# EAGLE design rfob (EAGLE 6.6.0)
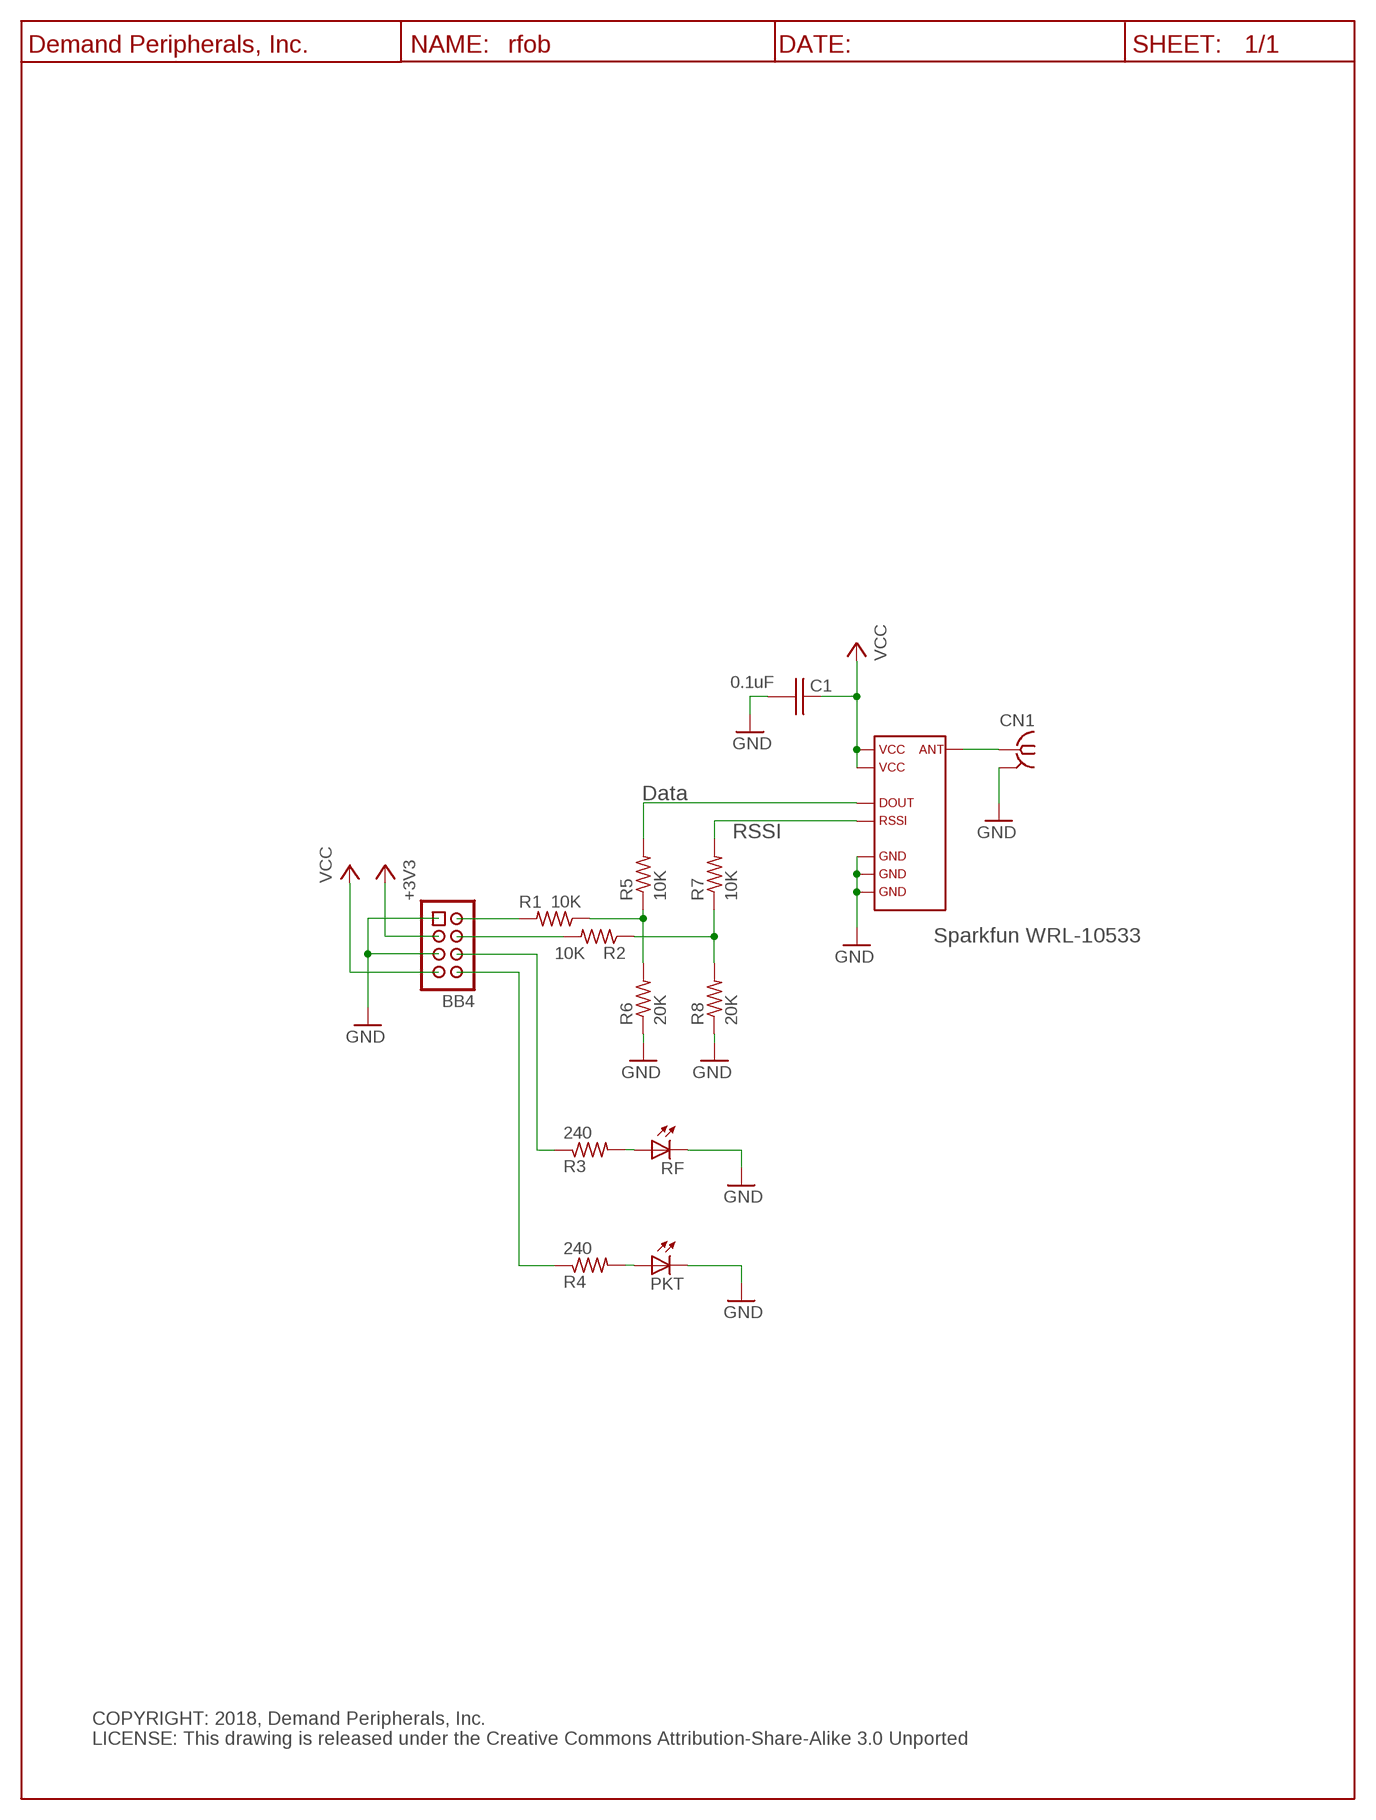
[diagram p0: schematic, sheet 1]

## Parts
BB4  Keyed_Pin_Header_4x2(0.1"x0.1")  HDR-4X2-SHR  [HDR-4X2]
C1  0.1uF  C0.1UF_C0603  [C0603]
CN1  BU-SMA-V  [BU-SMA-V]
PKT  LED-0805-RED  [0805]
R1  10K  R10K_R0603  [R0603]
R2  10K  R10K_R0603  [R0603]
R3  240  R240_  [R0603]
R4  240  R240_  [R0603]
R5  10K  R10K_R0603  [R0603]
R6  20K  R20K_R0603  [R0603]
R7  10K  R10K_R0603  [R0603]
R8  20K  R20K_R0603  [R0603]
RF  LED-0805-GRN  [0805]
RF1  RFLINK  [RFLINK]
U$1  DP_FRAME_P  [P_FRAME]

## Nets
+3V3: BB4.3
GND: BB4.1 BB4.5 C1.2 CN1.2 CN1.3 CN1.4 CN1.5 PKT.C R6.1 R8.1 RF1.1(GND1) RF1.6(GND3) RF1.7(GND2) RF.C
N$1: R3.2 RF.A
N$2: BB4.6 R3.1
N$3: R7.2 RF1.3(RSSI)
N$4: R2.1 R7.1 R8.2
N$5: R1.1 R5.1 R6.2
N$6: R5.2 RF1.2(DOUT)
N$7: BB4.8 R4.1
N$8: PKT.A R4.2
N$9: BB4.2 R1.2
N$10: BB4.4 R2.2
N$11: CN1.1 RF1.8(ANT)
VCC: BB4.7 C1.1 RF1.4(VCC1) RF1.5(VCC2)

## Notes on the sheet
- Data
- RSSI
- Sparkfun WRL-10533
- COPYRIGHT: 2018, Demand Peripherals, Inc.
  LICENSE: This drawing is released under the Creative Commons Attribution-Share-Alike 3.0 Unported

## Library data of the parts
BB4 = dpi-conn:HDR-4X2-SHR: Shrouded 4x2 pin header; VENDOR: Digikey; VENDOR-PART-NUM: 609-3530-ND
C1 = dpi-passive:C0.1UF_: 0.1 uF Capacitor, 25V, X7R; VENDOR: Digikey; VENDOR-PART-NUM: 1276-1126-2-ND
CN1 = dpi-conn:BU-SMA-V: FEMALE SMA CONNECTOR; VENDOR: Digikey; VENDOR-PART-NUM: A97594-ND
PKT = dpi-diopto:LED-0805-RED: Red 0805 LED, 41mcd@20ma, 160degree; VENDOR: Digikey; VENDOR-PART-NUM: 475-1415-6-ND
R1 R2 R5 R7 = dpi-passive:R10K_: 10K Resistor, 1%, 0.1 watt; VENDOR: Digikey; VENDOR-PART-NUM: 311-1.00KHRTR-ND
R3 R4 = dpi-passive:R240_: 240 Ohm resistor, 1%, 0.1 watt; VENDOR: Digikey; VENDOR-PART-NUM: 311-240HRTR-ND
R6 R8 = dpi-passive:R20K_: 20K Resistor, 1%, 0.1 watt; VENDOR: Digikey; VENDOR-PART-NUM: 311-20.0KHRTR-ND
RF = dpi-diopto:LED-0805-GRN: Green 0805 LED, 26mcd@20ma, 160degree; VENDOR: Digikey; VENDOR-PART-NUM: 475-1410-1-ND
RF1 = dpi-swsens:RFLINK: SparkFun RF-Link module or equivalent; VENDOR: Sparkfun; VENDOR-PART-NUM: WRL-10533
U$1 = dpi-sym:DP_FRAME_P: Portrait/Letter Document Frame

## Board
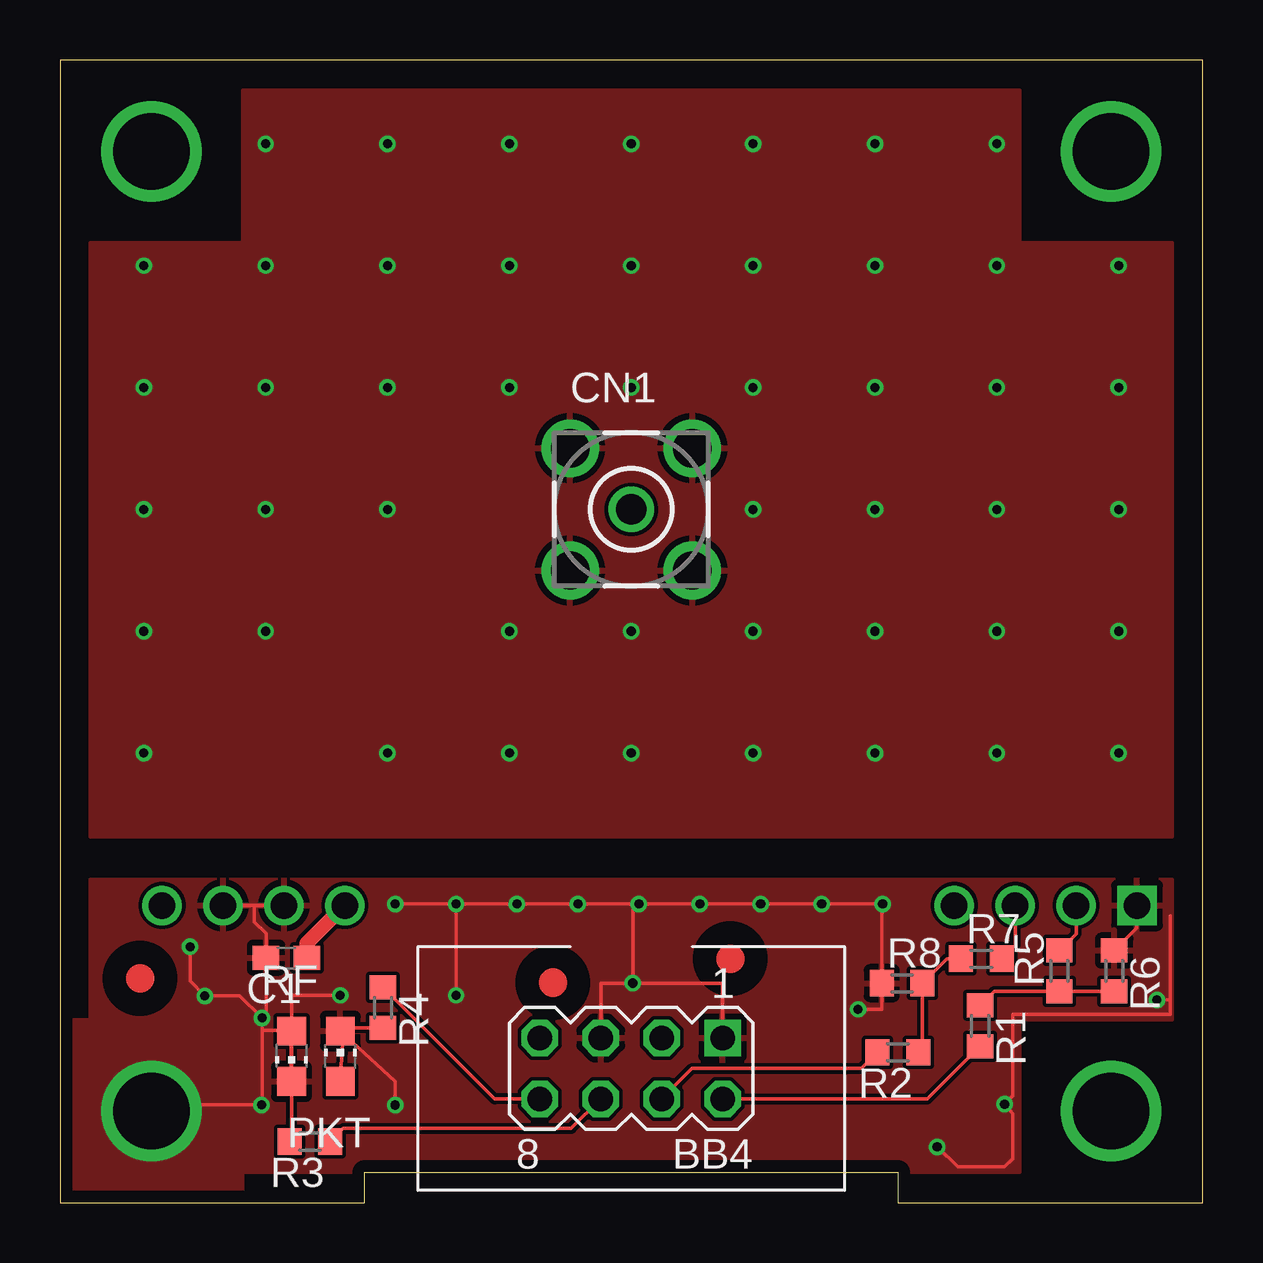
[diagram p1: board, top side]
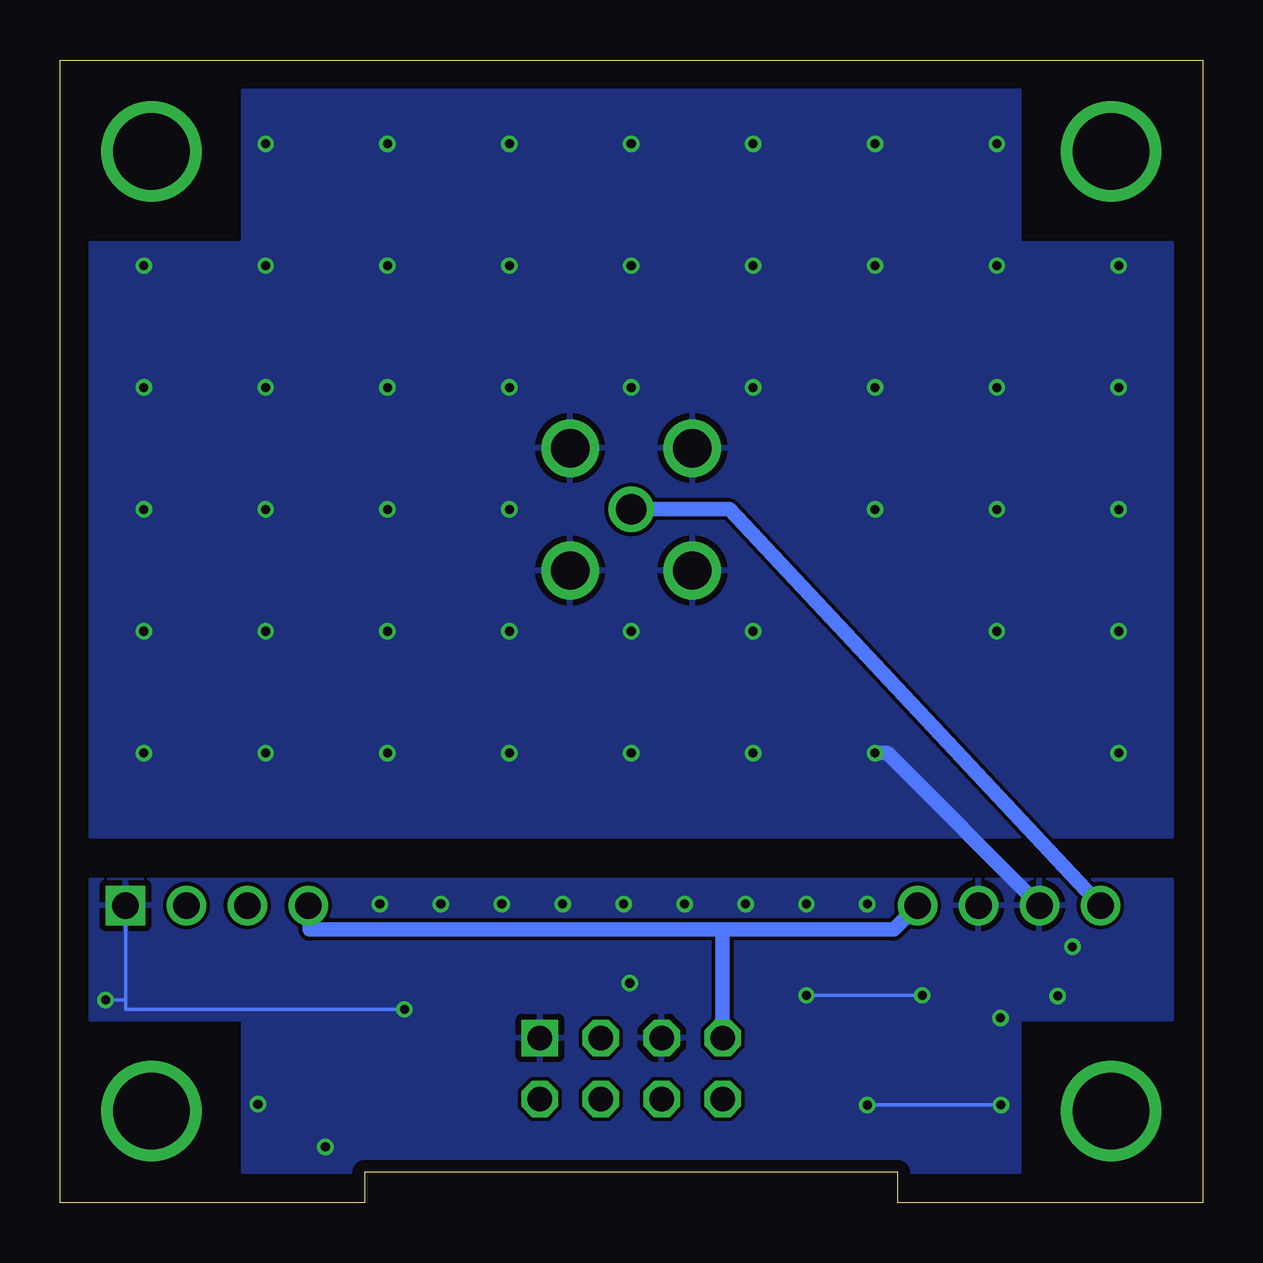
[diagram p2: board, bottom side, seen from below]

Size 47.62 x 47.62 mm. Coordinates in mm from the lower left corner, seen from the top.
Outline: 0,0 12.7,0 12.7,1.27 34.92,1.27 34.92,0 47.62,0 47.62,47.62 0,47.62 0,0
Copper layers (1*16): Top 0.035mm / dielectric 1.5mm / Bottom 0.035mm
Design rules "default *": minimum track width 6mil, minimum drill 15mil, track to track 6mil, track to pad 6mil, pad to pad 6mil, via to via 6mil, smd to smd 6mil, copper to edge 20mil, drill to drill 12mil, minimum pad ring 6mil, minimum via ring 6mil, stop-mask expansion 4mil, vias tented up to drill 0mil, thermal gap 10mil
tKeepout: area 15.1,1 to 32.5,10.2

### Footprints (pad centres in the part's own frame; a part is rotated, then mirrored left to right if it is on the bottom)
HDR-4X2 = drill 1.016 square: 1 -3.81,-1.27 | drill 1.016 octagon: 2 -3.81,1.27; 3 -1.27,-1.27; 4 -1.27,1.27; 5 1.27,-1.27; 6 1.27,1.27; 7 3.81,-1.27; 8 3.81,1.27
C0603 = smd 1.1 x 1: 1 -0.85,0; 2 0.85,0
BU-SMA-V = drill 1.27: 1 0,0 | drill 1.6: 2 -2.55,2.55; 3 2.55,2.55; 4 2.55,-2.55; 5 -2.55,-2.55
0805 = smd 1.2 x 1.2: A -1.05,0; C 1.05,0
R0603 = smd 1 x 1.1: 1 -0.85,0; 2 0.85,0
RFLINK = drill 1.1 square: 1 -20.32,0 | drill 1.1: 2 -17.78,0; 3 -15.24,0; 4 -12.7,0; 5 12.7,0; 6 15.24,0; 7 17.78,0; 8 20.32,0

### Placement (x,y rotation side)
BB4  23.81,5.59 180 top
C1  9.44,10.2 180 top
CN1  23.81,28.89 0 top
PKT  11.68,6.1 90 top
R1  38.35,7.37 270 top
R2  34.92,6.26 180 top
R3  10.41,2.54 180 top
R4  13.46,8.13 270 top
R5  41.66,9.65 90 top
R6  43.94,9.65 270 top
R7  38.4,10.16 0 top
R8  35.1,9.14 0 top
RF  9.65,6.1 270 top
RF1  24.57,12.38 180 top
U$1  -2.54,-2.54 0 top
U$2  [FIDUCIAL]  20.55,9.17 0 top
U$3  [FIDUCIAL]  27.94,10.16 0 top
U$4  [FIDUCIAL]  3.34,9.35 0 top
U$5  [DPI-2]  16.26,41.91 0 bottom

### Tracks (layer width: path | path; a pad name or v marks a point on that pad's centre or on a via)
GND  (via drill 0.38, 3.17 pad 3.17)
  Top 0.152: 46.29,8.45 46.29,7.84 39.72,7.84 39.72,4.44 v39.38,4.1 39.71,3.7 39.71,1.83 39.37,1.49 37.44,1.49 v36.56,2.32 | 46.29,8.45 46.29,11.94 | v13.97,12.45 v16.51,12.45 | v16.51,12.45 v19.05,12.45 v21.59,12.45 v24.13,12.45 | v26.67,12.45 v29.21,12.45 v31.75,12.45 v34.29,12.45 34.25,12.45 R8.1 34.25,8.05 v33.26,8.05 | v24.13,12.45 v26.67,12.45 | v45.72,8.44 46.29,8.44 46.29,8.45 | v26.67,12.45 27.62,12.45 | v24.13,12.45 22.54,12.45 | R6.1 44.9,11.45 RF1.1 | 8.42,7.18 8.42,4.09 v8.4,4.07 4.07,4.07 v3.81,3.81 | 8.42,7.18 v8.42,7.69 | 8.42,7.18 9.62,7.18 RF.C 9.65,8.64 v11.68,8.64 | v8.42,7.69 8.59,7.86 C1.2 8.59,11.21 8.1,11.7 8.1,12.37 8.12,12.38 | v8.42,7.69 7.5,8.61 v6.04,8.61 5.42,9.23 v5.42,10.66 | BB4.1 27.62,9.14 v23.88,9.14 | BB4.5 22.54,9.14 v23.88,9.14 | v23.88,9.14 23.88,12.45 v24.13,12.45 | v16.51,8.64 v16.51,12.45 | PKT.C 13.97,5.05 v13.97,4.06 | 8.59,12.38 RF1.6 8.12,12.38 | RF1.7 8.12,12.38
  Bottom 0.152: RF1.1 44.9,8.05 | 44.9,8.05 v33.26,8.05 | 44.9,8.05 44.9,8.44 v45.72,8.44 | v11.68,8.64 v16.51,8.64 | v13.97,4.06 v8.4,4.06 v8.4,4.07
  Bottom 0.61: v13.65,18.73 13.14,18.73 RF1.7
  other vias: 3.49,39.05 8.57,39.05 13.65,39.05 18.73,39.05 23.81,39.05 28.89,39.05 33.97,39.05 39.05,39.05 44.13,39.05 8.57,44.13 13.65,44.13 18.73,44.13 23.81,44.13 28.89,44.13 33.97,44.13 3.49,33.97 8.57,33.97 13.65,33.97 18.73,33.97 23.81,33.97 28.89,33.97 33.97,33.97 39.05,33.97 44.13,33.97 3.49,28.89 8.57,28.89 13.65,28.89 18.73,23.81 23.81,23.81 28.89,28.89 33.97,28.89 39.05,28.89 44.13,28.89 3.49,23.81 8.57,23.81 28.89,23.81 33.97,23.81 39.05,23.81 44.13,23.81 3.49,18.73 18.73,18.73 23.81,18.73 28.89,18.73 33.97,18.73 39.05,18.73 44.13,18.73 39.05,44.13
  pour Top (isolate 0.152): 0.51,7.62 1.27,7.62 1.27,13.46 46.35,13.46 46.35,7.62 40.01,7.62 40.01,1.27 7.62,1.27 7.62,0.51 0.51,0.51
  pour Bottom: 1.27,7.62 1.27,13.46 46.35,13.46 46.35,7.62 40.01,7.62 40.01,1.27 7.62,1.27 7.62,7.62
  pour Bottom: 46.35,40.01 46.35,15.24 1.27,15.24 1.27,40.01 7.62,40.01 7.62,46.35 40.01,46.35 40.01,40.01
  pour Top: 46.35,40.01 46.35,15.24 1.27,15.24 1.27,40.01 7.62,40.01 7.62,46.35 40.01,46.35 40.01,40.01
MOUNT  (via drill 3.17 pad 3.17)
  other vias: 3.81,43.81
N$1
  Top 0.152: R3.2 9.65,2.64 RF.A
N$2
  Top 0.152: R3.1 11.81,3.09 20.8,3.09 21.31,3.09 BB4.6
N$3
  Top 0.152: R7.2 39.81,10.72 RF1.3
N$4
  Top 0.152: R7.1 36.97,10.16 R8.2 35.95,6.44 R2.1
N$5
  Top 0.152: R6.2 R5.1 38.94,8.8 R1.1
N$6
  Top 0.152: R5.2 42.35,11.2 RF1.2
N$7
  Top 0.152: BB4.8 18.12,4.32 R4.1
N$8
  Top 0.152: R4.2 11.82,7.28 PKT.A
N$9
  Top 0.152: BB4.2 36.16,4.32 R1.2
N$10
  Top 0.152: BB4.4 26.35,5.59 31.46,5.59 33.4,5.59 R2.2
N$11
  Bottom 0.61: RF1.8 19.72,28.91 23.8,28.91 CN1.1
N$19  (via drill 3.17 pad 3.17)
  other vias: 43.81,3.81
N$20  (via drill 3.17 pad 3.17)
  other vias: 43.81,43.81
VCC
  Top 0.61: C1.1 10.29,10.79 RF1.5
  Bottom 0.61: 20.01,11.38 12.94,11.38 12.87,11.38 RF1.5 | 20.01,11.38 37.23,11.38 37.23,12.34 RF1.4 | 20.01,11.38 20,11.37 | 20,11.37 BB4.7 | 20.01,11.38 20,11.37

### Text on the board
tTest: 1.875 Inches | 1.575 Inches | Rev 17A | RFOB | (C) 2017, Demand Peripherals, Inc. | 1.575 Inches | 1.875 Inches | BB4 | C1 | R4 | R8 | R7 | R6 | R5 | R1 | R2 | RF | Pkt | R3